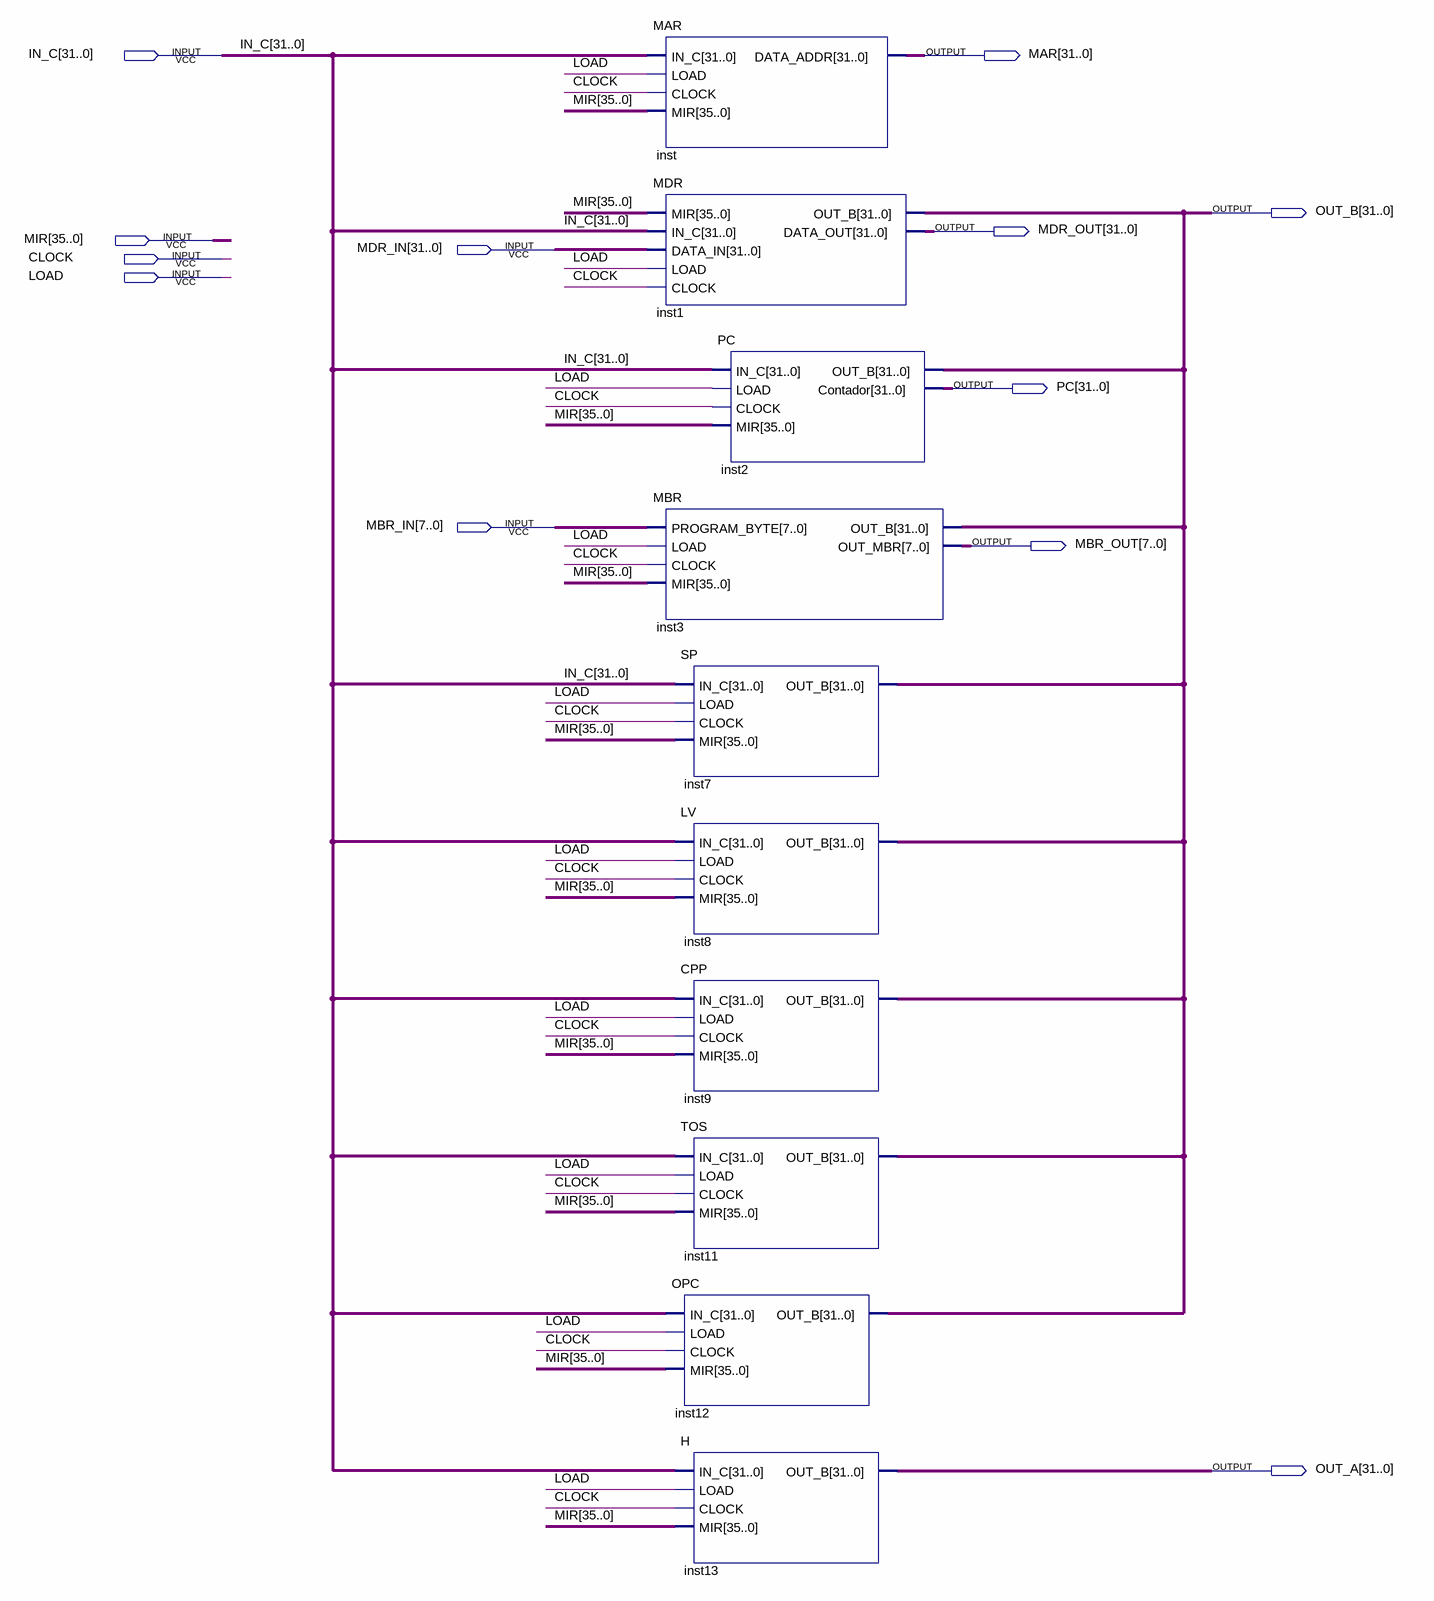
[diagram p0: schematic sheet]
// Quartus schematic BANCK_REGISTERS.bdf as structural Verilog: 10 symbols, 12 pins
module BANCK_REGISTERS (
  input  [31:0] IN_C,
  input  [35:0] MIR,
  input  [31:0] MDR_IN,
  input  CLOCK,
  input  LOAD,
  input  [7:0] MBR_IN,
  output [31:0] MAR,
  output [31:0] OUT_B,
  output [31:0] MDR_OUT,
  output [31:0] PC,
  output [7:0] MBR_OUT,
  output [31:0] OUT_A
);

  MAR inst (.IN_C(IN_C), .LOAD(LOAD), .CLOCK(CLOCK), .MIR(MIR), .DATA_ADDR(MAR));
  MDR inst1 (.MIR(MIR), .IN_C(IN_C), .DATA_IN(MDR_IN), .LOAD(LOAD), .CLOCK(CLOCK), .OUT_B(OUT_B), .DATA_OUT(MDR_OUT));
  MBR inst3 (.PROGRAM_BYTE(MBR_IN), .LOAD(LOAD), .CLOCK(CLOCK), .MIR(MIR), .OUT_B(OUT_B), .OUT_MBR(MBR_OUT));
  SP inst7 (.IN_C(IN_C), .LOAD(LOAD), .CLOCK(CLOCK), .MIR(MIR), .OUT_B(OUT_B));
  LV inst8 (.IN_C(IN_C), .LOAD(LOAD), .CLOCK(CLOCK), .MIR(MIR), .OUT_B(OUT_B));
  CPP inst9 (.IN_C(IN_C), .LOAD(LOAD), .CLOCK(CLOCK), .MIR(MIR), .OUT_B(OUT_B));
  TOS inst11 (.IN_C(IN_C), .LOAD(LOAD), .CLOCK(CLOCK), .MIR(MIR), .OUT_B(OUT_B));
  OPC inst12 (.IN_C(IN_C), .LOAD(LOAD), .CLOCK(CLOCK), .MIR(MIR), .OUT_B(OUT_B));
  H inst13 (.IN_C(IN_C), .LOAD(LOAD), .CLOCK(CLOCK), .MIR(MIR), .OUT_B(OUT_A));
  PC inst2 (.IN_C(IN_C), .LOAD(LOAD), .CLOCK(CLOCK), .MIR(MIR), .OUT_B(OUT_B), .Contador(PC));
endmodule
